# EAGLE schematic schema (EAGLE 9.0.1)
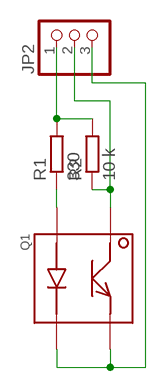
[diagram p0: schematic, sheet 1]

## Parts
JP2  PINHD-1X3  [1X03]
Q1  QRD1114  [QRD1114]
R1  330  R-EU_MELF0102W  [MINI_MELF-0102W]
R2  10 k  R-EU_MELF0102W  [MINI_MELF-0102W]

## Nets
N$1: Q1.P$3 R1.1
N$2: JP2.2 Q1.P$1 R2.1
N$3: JP2.1 R1.2 R2.2
N$4: JP2.3 Q1.P$2 Q1.P$4

## Library data of the parts
JP2 = pinhead:PINHD-1X3: PIN HEADER
Q1 = QRD1114:QRD1114; AVAILABILITY: Good; DESCRIPTION: QRD1114 Series 30 V 50 mA Phototransistor Reflective Object Sensor; MF: ON Semiconductor; MP: QRD1114; PACKAGE: Radial-4 ON Semiconductor; PRICE: 0.97 USD
R1 R2 = resistor:R-EU_: RESISTOR, European symbol